# Altium schematic sheet Sheet1.SchDoc
size A4
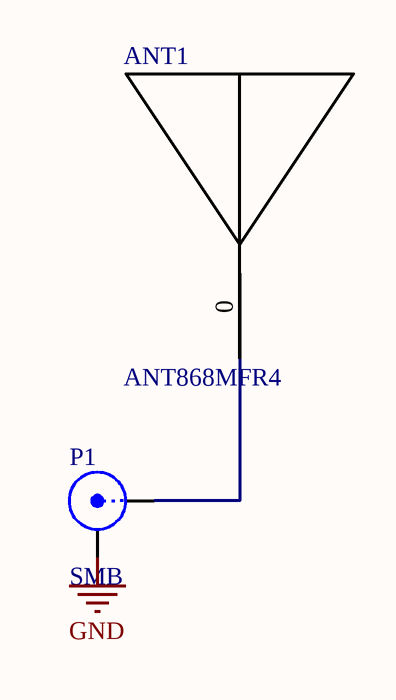
[diagram p0: Sheet1.SchDoc]

## Parts
ANT1  ANT868MFR4  [ANT868MFR4]
P1  SMB  [SMB_V-RJ45]

## Nets
GND: P1.2(Y)
NetANT1_0: ANT1.0 P1.1(X)

## Library data of the parts
P1 = SMB: SMB Straight Connector; LatestRevisionDate: 17-Jul-2002; LatestRevisionNote: Re-released for DXP Platform.; Publisher: Altium Limited